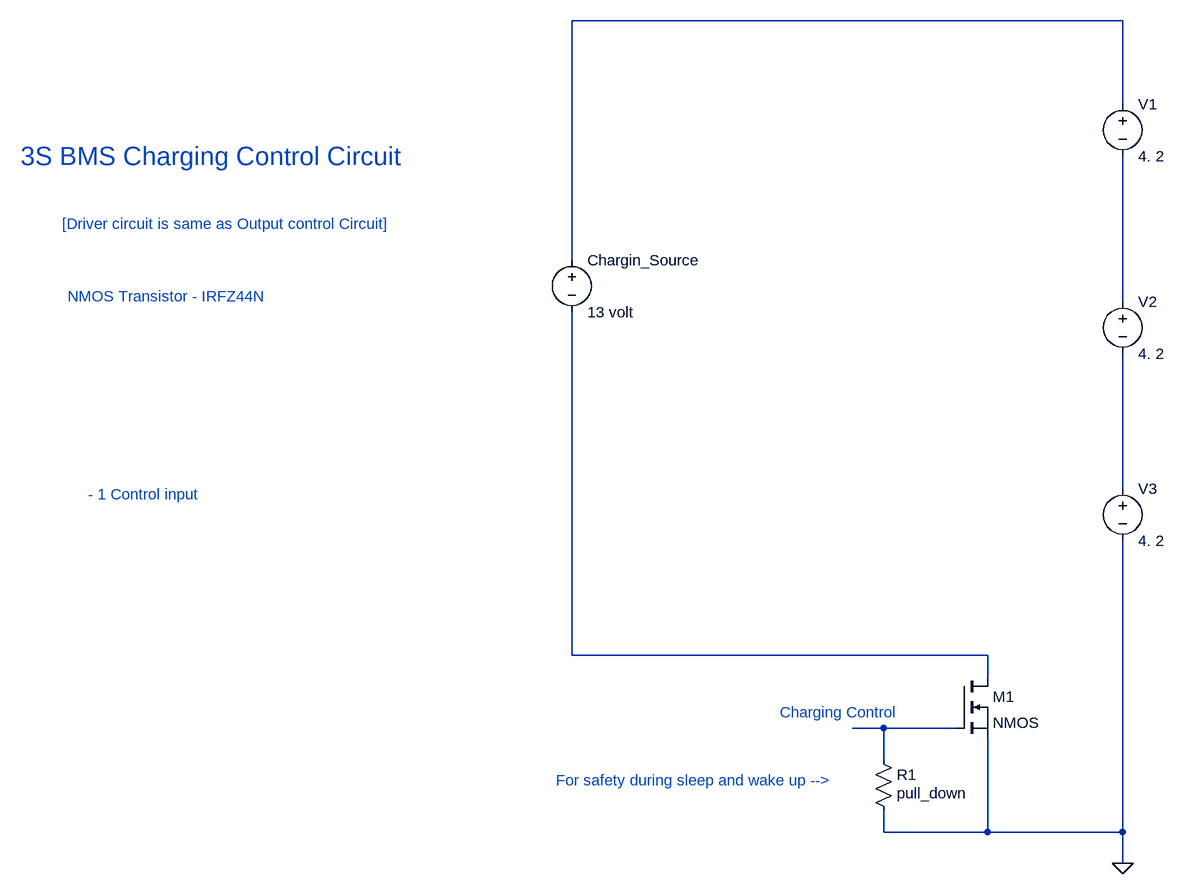
[diagram p0: schematic 3S Charging Control Circuit.asc]
3S Charging Control Circuit.asc, the LTspice schematic file:
Version 4
SHEET 1 880 1220
WIRE 192 -96 -656 -96
WIRE 192 32 192 -96
WIRE -656 272 -656 -96
WIRE 192 336 192 112
WIRE 192 624 192 416
WIRE -656 880 -656 352
WIRE -16 880 -656 880
WIRE -16 912 -16 880
WIRE -176 992 -224 992
WIRE -64 992 -176 992
WIRE -176 1040 -176 992
WIRE -176 1152 -176 1120
WIRE -16 1152 -16 1008
WIRE -16 1152 -176 1152
WIRE 192 1152 192 704
WIRE 192 1152 -16 1152
WIRE 192 1200 192 1152
FLAG 192 1200 0
SYMBOL voltage 192 16 R0
WINDOW 123 0 0 Left 0
WINDOW 39 0 0 Left 0
SYMATTR InstName V1
SYMATTR Value 4. 2
SYMBOL voltage 192 320 R0
WINDOW 123 0 0 Left 0
WINDOW 39 0 0 Left 0
SYMATTR InstName V2
SYMATTR Value 4. 2
SYMBOL voltage 192 608 R0
WINDOW 123 0 0 Left 0
WINDOW 39 0 0 Left 0
SYMATTR InstName V3
SYMATTR Value 4. 2
SYMBOL voltage -656 256 R0
WINDOW 123 0 0 Left 0
WINDOW 39 0 0 Left 0
SYMATTR InstName Chargin_Source
SYMATTR Value 13 volt
SYMBOL nmos -64 912 R0
SYMATTR InstName M1
SYMBOL res -192 1024 R0
WINDOW 3 36 68 Left 2
SYMATTR InstName R1
SYMATTR Value pull_down
TEXT -336 968 Left 2 ;Charging Control
TEXT -1504 112 Left 4 ;3S BMS Charging Control Circuit
TEXT -1440 216 Left 2 ;[Driver circuit is same as Output control Circuit]
TEXT -1432 328 Left 2 ;NMOS Transistor - IRFZ44N
TEXT -1400 632 Left 2 ;- 1 Control input
TEXT -680 1072 Left 2 ;For safety during sleep and wake up -->

The netlist it stands for:
* 3S Charging Control Circuit.asc
V1 N001 N002 4. 2
V2 N002 N003 4. 2
V3 N003 0 4. 2
V§Chargin_Source N001 N004 13 volt
M1 N004 N005 0 0 NMOS
R1 N005 0 pull_down
.model NMOS NMOS
.model PMOS PMOS
.lib standard.mos
* Charging Control
* 3S BMS Charging Control Circuit
* [Driver circuit is same as Output control Circuit]
* NMOS Transistor - IRFZ44N
* - 1 Control input
* For safety during sleep and wake up -->
.backanno
.end